# EasyEDA Pro project ProPrj_nrf52833_LighthouseTag_2025-07-26.epro, schematic Schematic4_3
Board Name: TS4231_test_board; Create Date: 2025-07-26; Page Name: P1; Project Name: nrf52833_LighthouseTag; Schematic Name: Schematic4_3; Update Date: 2025-07-26; Company: 嘉立创EDA; Page Size: A4; Version: V1.0
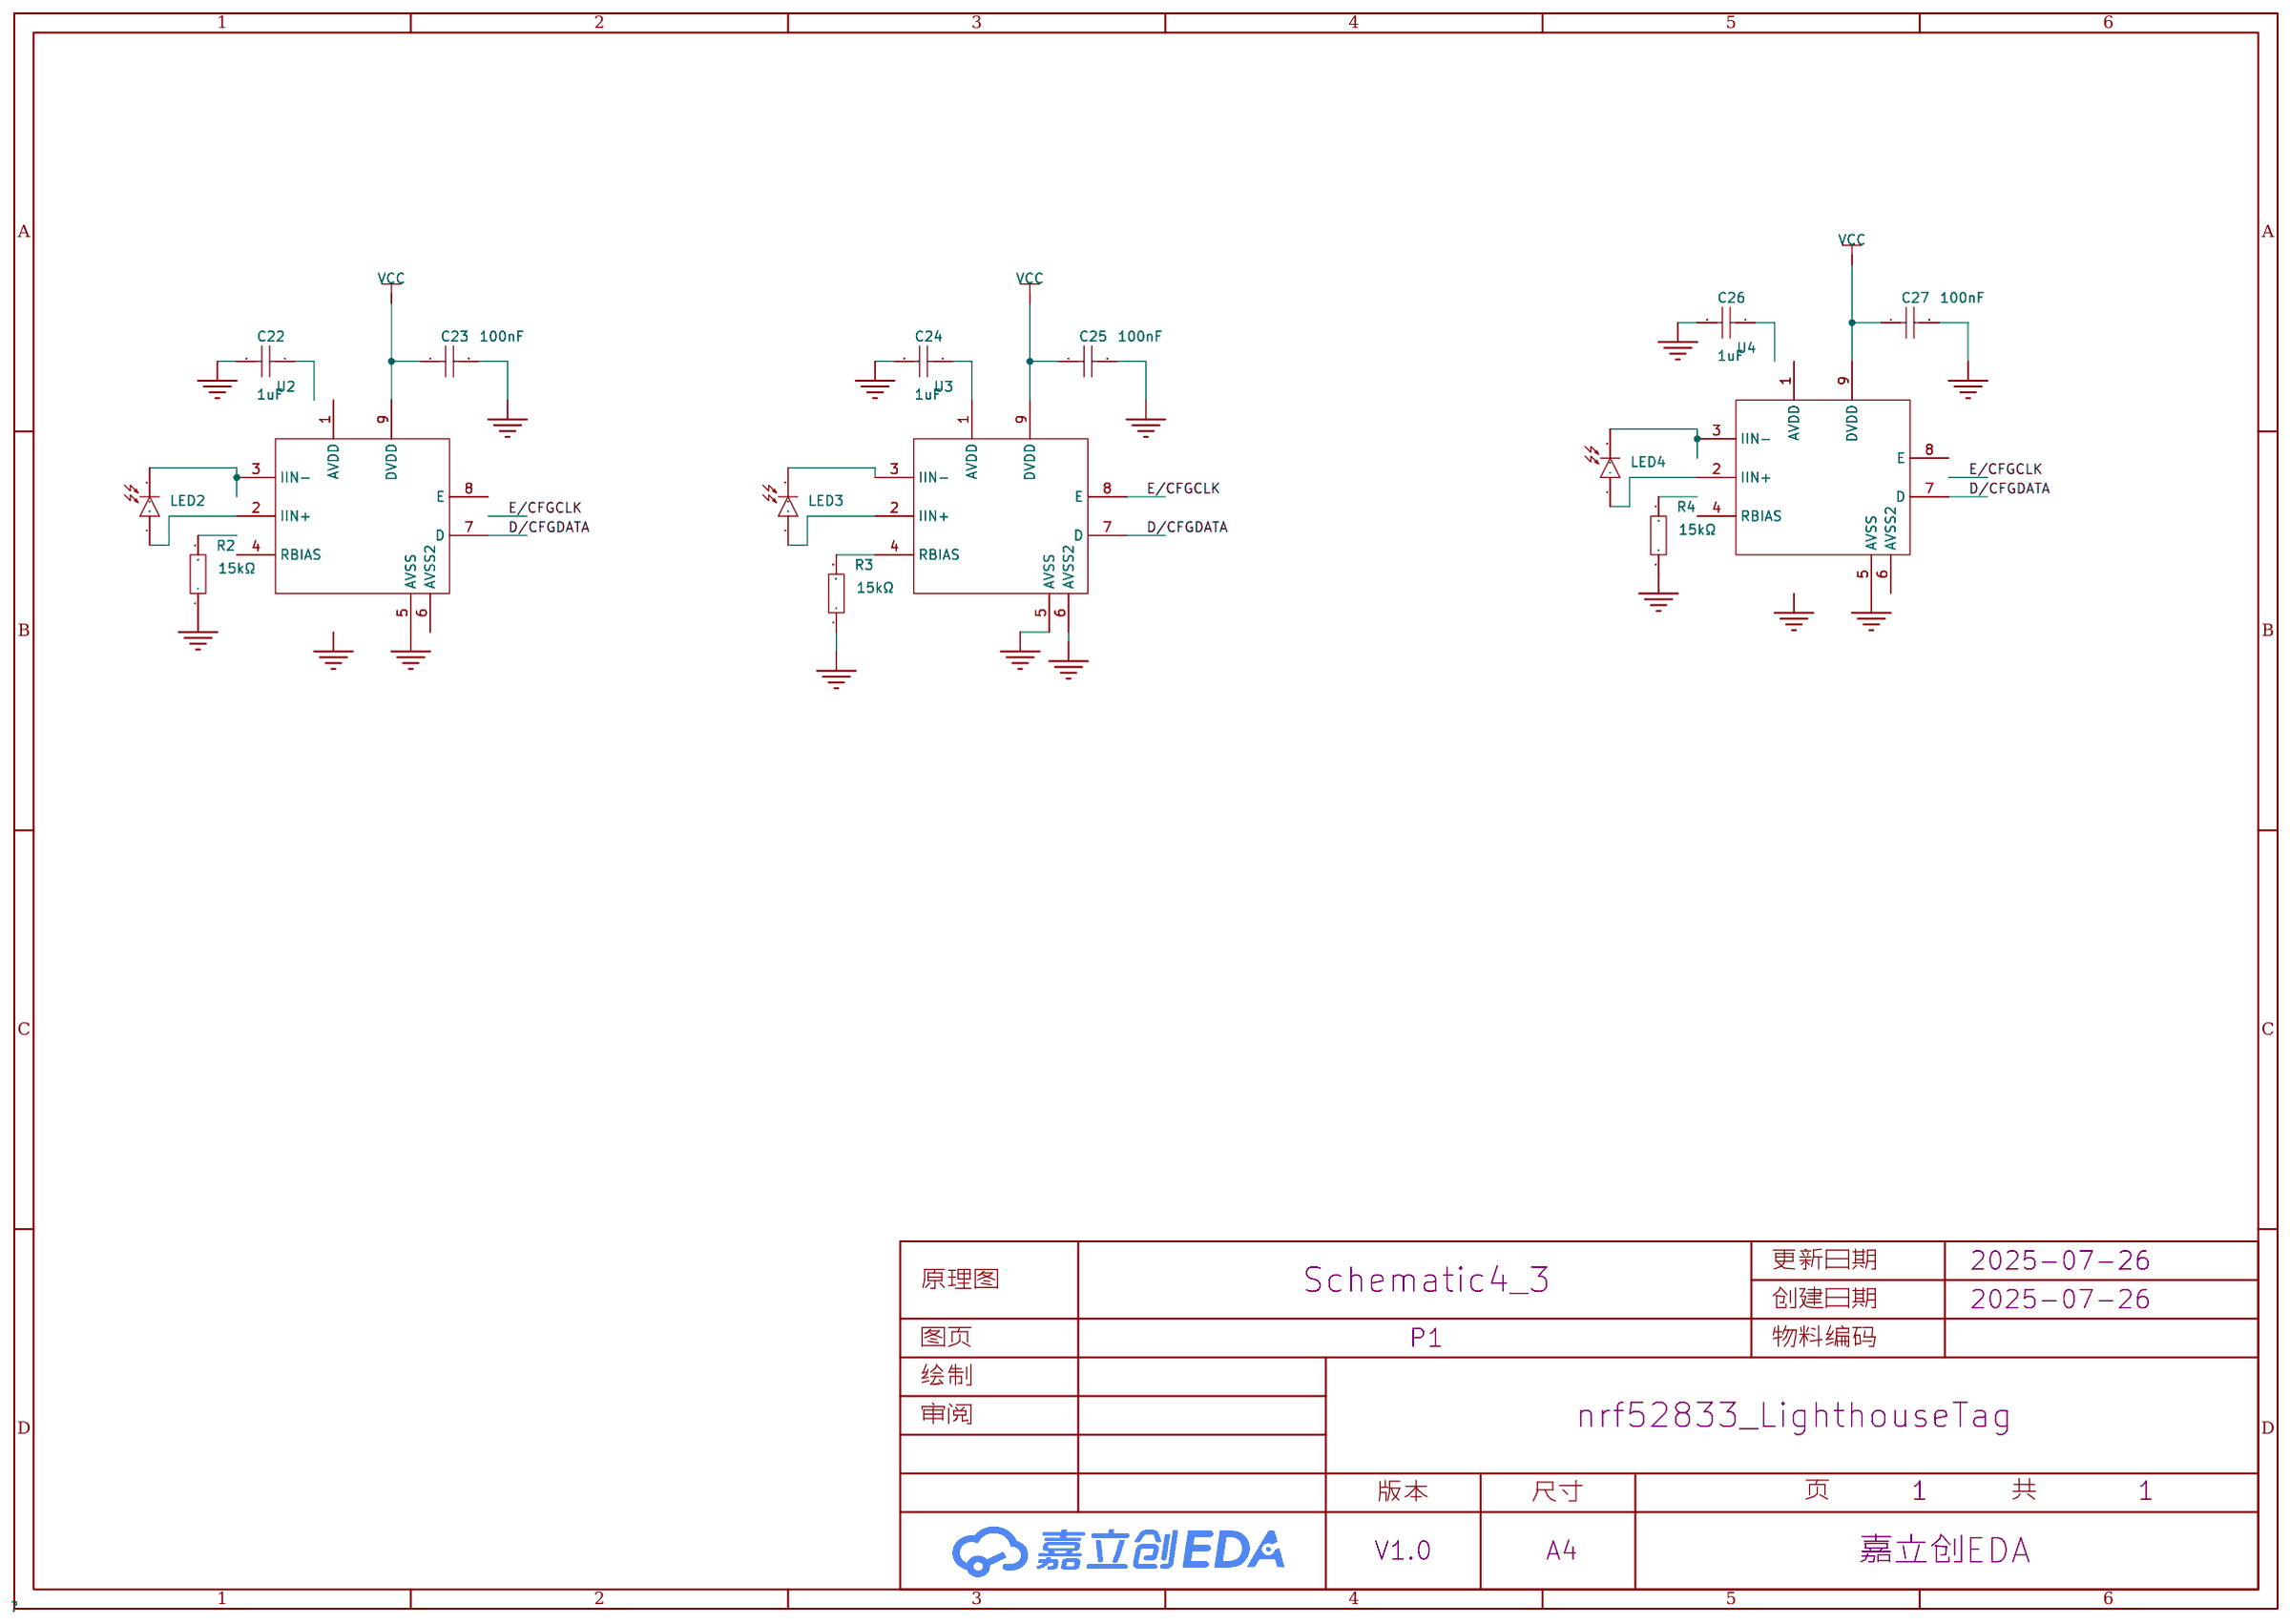
[diagram p3: schematic sheet]

## Parts
C22  1uF  [C0201]
C23  100nF  [C0201]
C24  1uF  [C0201]
C25  100nF  [C0201]
C26  1uF  [C0201]
C27  100nF  [C0201]
LED2  VBPW34S  [SENSOR-SMD_L4.4-W3.9]
LED3  VBPW34S  [SENSOR-SMD_L4.4-W3.9]
LED4  VBPW34S  [SENSOR-SMD_L4.4-W3.9]
R2  15kΩ  [R0402]
R3  15kΩ  [R0402]
R4  15kΩ  [R0402]
U2  -  [TS4231]
U3  -  [TS4231]
U4  -  [TS4231]

## Library data of the parts
C22 C24 C26 = GRM033R61A105ME44D: 容值:1uF;精度:±20%;额定电压:10V;材质(温度系数):X5R;; LCSC Part Name: 1uF ±20% 10V; Supplier Part: C76935; Manufacturer: muRata(村田); Supplier Footprint: 0201; JLCPCB Part Class: 扩展库; Datasheet: https://atta.szlcsc.com/upload/public/pdf/source/20190904/C426118_85E81C7C1F21FC87C5FB6D536E0847B4.pdf; Supplier: LCSC; Tolerance: ±20%; Voltage Rated: 10V; Temperature Coefficient: X5R
C23 C25 C27 = GRM033R61E104KE14D: 容值:100nF;精度:±10%;额定电压:25V;温度系数:X5R;; LCSC Part Name: 100nF ±10% 25V; Supplier Part: C76939; Manufacturer: muRata(村田); Supplier Footprint: 0201; JLCPCB Part Class: 扩展库; Datasheet: https://atta.szlcsc.com/upload/public/pdf/source/20180307/C76939_15204091018551407727.pdf; Supplier: LCSC; Tolerance: ±10%; Voltage Rating: 25V; Temperature Coefficient: X5R
LED2-LED4 = VBPW34S: 反向电压:60V;接收角:-;峰值波长:940nm;频谱范围:430nm~1100nm;暗电流:2nA;; LCSC Part Name: 940nm 频谱范围430nm~1100nm 反向电压60V; Supplier Part: C145262; Manufacturer: VISHAY(威世); Supplier Footprint: SMD,3.9x4.4mm; JLCPCB Part Class: Extended Part; Datasheet: https://atta.szlcsc.com/upload/public/pdf/source/20171211/C145262_15129614507721174601.pdf; Supplier: LCSC; DC Reverse Voltage: 60V; Peak  Wavelength: 940nm; Spectral Range: 430nm~1100nm; Current Dark: 2nA; Operating Temperature: -40~+100
R2-R4 = 0402WGF1502TCE: 电阻类型:厚膜电阻;阻值:15kΩ;精度:±1%;功率:62.5mW;最大工作电压:50V;温度系数:±100ppm/;; LCSC Part Name: 15kΩ ±1% 62.5mW 厚膜电阻; Supplier Part: C25756; Manufacturer: UNI-ROYAL(厚声); Supplier Footprint: 0402; JLCPCB Part Class: Basic Part; Datasheet: https://atta.szlcsc.com/upload/public/pdf/source/20200306/C422600_1E6D84923E4A46A82E41ADD87F860B5C.pdf; Supplier: LCSC; Type: 厚膜电阻; Tolerance: ±1%; Power(Watts): 62.5mW; Overload Voltage (Max): 50V; Temperature Coefficient: ±100ppm/; Operating Temperature Range: -55~+155
U2-U4 = TS4231

## Nets
GND: C22.2 C23.2 C24.2 C25.2 C26.2 C27.2 R2.1 R3.1 R4.1 U2.5(AVSS) U3.5(AVSS) U3.6(AVSS2) U4.5(AVSS)
VCC: C23.1 C25.1 C27.1 U2.9(DVDD) U3.9(DVDD) U4.9(DVDD)
D/CFGDATA: U2.7(D) U3.7(D) U4.7(D)
E/CFGCLK: U3.8(E)
$1N11226: LED2.1(A) U2.2(IIN+)
$1N34196: C24.1 U3.1(AVDD)
$1N34199: LED3.2(C) U3.3(IIN-)
$1N34200: LED3.1(A) U3.2(IIN+)
$1N34201: R3.2 U3.4(RBIAS)
$1N34472: LED4.1(A) U4.2(IIN+)
Net-(LED2-2): LED2.2(C) U2.3(IIN-)
Net-(LED4-2): LED4.2(C) U4.3(IIN-)

Not connected (* = marked no-connect by the designer): C22 1; C26 1; R2 2; R4 2; U2 1(AVDD) 4(RBIAS) 6(AVSS2) 8(E); U4 1(AVDD) 4(RBIAS) 6(AVSS2) 8(E)
